# Altium schematic sheet bREAKOUT.SchDoc: Breakout Points
size Letter; Date: Jul 31/2018; Revision: 1; SheetNumber: 9; SheetTotal: 9
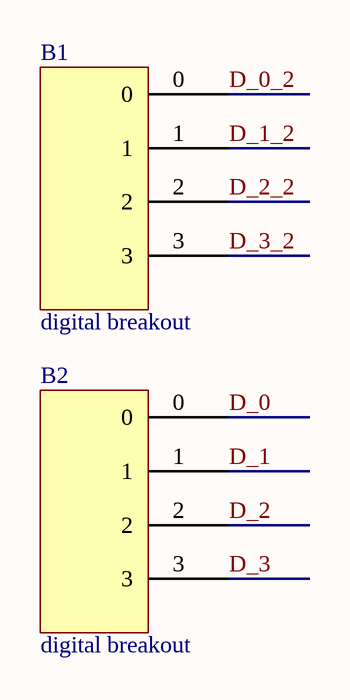
[diagram p0: bREAKOUT.SchDoc]

## Parts
B1  digital breakout  [Digital_I/O]
B2  digital breakout  [Digital_I/O]

## Nets
D_0: B2.0
D_0_2: B1.0
D_1: B2.1
D_1_2: B1.1
D_2: B2.2
D_2_2: B1.2
D_3: B2.3
D_3_2: B1.3

## Notes on the sheet
- Date:
- Revision:
- Sheet:
- /

## Library data of the parts
B1 B2 = Digital_I/O